# Altium schematic sheet [5]wled.SchDoc
size A
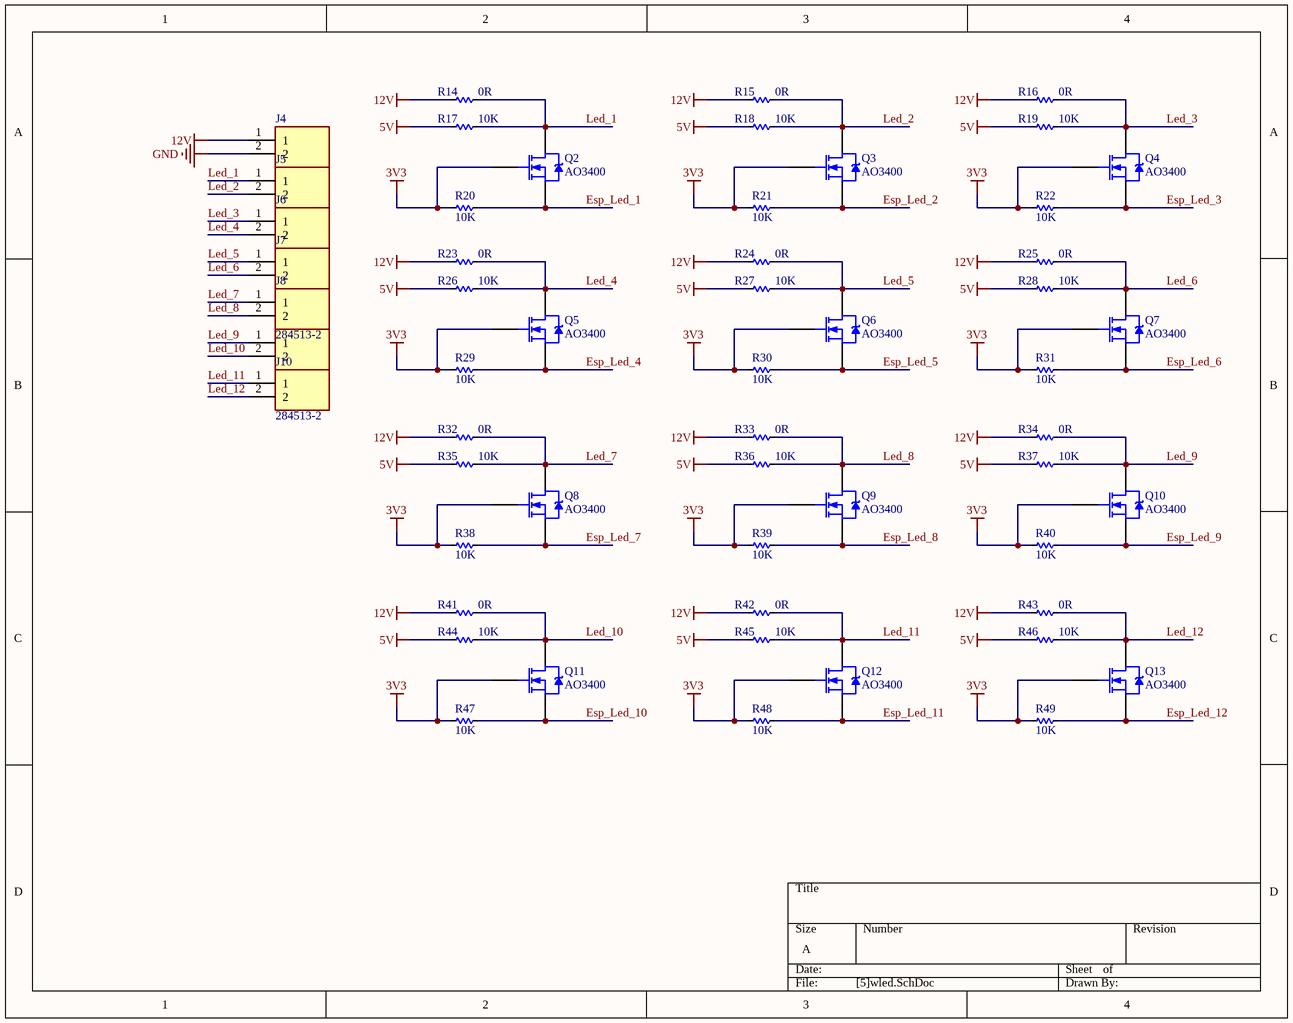
[diagram p0: [5]wled.SchDoc]

## Parts
J4  284513-2  [SHDRRA2W80P0X381_1X2_863X920X730P]
J5  284513-2  [SHDRRA2W80P0X381_1X2_863X920X730P]
J6  284513-2  [SHDRRA2W80P0X381_1X2_863X920X730P]
J7  284513-2  [SHDRRA2W80P0X381_1X2_863X920X730P]
J8  284513-2  [SHDRRA2W80P0X381_1X2_863X920X730P]
J9  284513-2  [SHDRRA2W80P0X381_1X2_863X920X730P]
J10  284513-2  [SHDRRA2W80P0X381_1X2_863X920X730P]
Q2  AO3400  [SOT-23_N]
Q3  AO3400  [SOT-23_N]
Q4  AO3400  [SOT-23_N]
Q5  AO3400  [SOT-23_N]
Q6  AO3400  [SOT-23_N]
Q7  AO3400  [SOT-23_N]
Q8  AO3400  [SOT-23_N]
Q9  AO3400  [SOT-23_N]
Q10  AO3400  [SOT-23_N]
Q11  AO3400  [SOT-23_N]
Q12  AO3400  [SOT-23_N]
Q13  AO3400  [SOT-23_N]
R14  0R  [RES-SMD-0805]
R15  0R  [RES-SMD-0805]
R16  0R  [RES-SMD-0805]
R17  10K  [RES-SMD-0805]
R18  10K  [RES-SMD-0805]
R19  10K  [RES-SMD-0805]
R20  10K  [RES-SMD-0805]
R21  10K  [RES-SMD-0805]
R22  10K  [RES-SMD-0805]
R23  0R  [RES-SMD-0805]
R24  0R  [RES-SMD-0805]
R25  0R  [RES-SMD-0805]
R26  10K  [RES-SMD-0805]
R27  10K  [RES-SMD-0805]
R28  10K  [RES-SMD-0805]
R29  10K  [RES-SMD-0805]
R30  10K  [RES-SMD-0805]
R31  10K  [RES-SMD-0805]
R32  0R  [RES-SMD-0805]
R33  0R  [RES-SMD-0805]
R34  0R  [RES-SMD-0805]
R35  10K  [RES-SMD-0805]
R36  10K  [RES-SMD-0805]
R37  10K  [RES-SMD-0805]
R38  10K  [RES-SMD-0805]
R39  10K  [RES-SMD-0805]
R40  10K  [RES-SMD-0805]
R41  0R  [RES-SMD-0805]
R42  0R  [RES-SMD-0805]
R43  0R  [RES-SMD-0805]
R44  10K  [RES-SMD-0805]
R45  10K  [RES-SMD-0805]
R46  10K  [RES-SMD-0805]
R47  10K  [RES-SMD-0805]
R48  10K  [RES-SMD-0805]
R49  10K  [RES-SMD-0805]

## Nets
3V3: Q2.1(G) Q3.1(G) Q4.1(G) Q5.1(G) Q6.1(G) Q7.1(G) Q8.1(G) Q9.1(G) Q10.1(G) Q11.1(G) Q12.1(G) Q13.1(G) R20.1 R21.1 R22.1 R29.1 R30.1 R31.1 R38.1 R39.1 R40.1 R47.1 R48.1 R49.1
5V: R17.1 R18.1 R19.1 R26.1 R27.1 R28.1 R35.1 R36.1 R37.1 R44.1 R45.1 R46.1
12V: J4.1 R14.1 R15.1 R16.1 R23.1 R24.1 R25.1 R32.1 R33.1 R34.1 R41.1 R42.1 R43.1
GND: J4.2
Esp_Led_1: Q2.2(S) R20.2
Esp_Led_2: Q3.2(S) R21.2
Esp_Led_3: Q4.2(S) R22.2
Esp_Led_4: Q5.2(S) R29.2
Esp_Led_5: Q6.2(S) R30.2
Esp_Led_6: Q7.2(S) R31.2
Esp_Led_7: Q8.2(S) R38.2
Esp_Led_8: Q9.2(S) R39.2
Esp_Led_9: Q10.2(S) R40.2
Esp_Led_10: Q11.2(S) R47.2
Esp_Led_11: Q12.2(S) R48.2
Esp_Led_12: Q13.2(S) R49.2
Led_1: J5.1 Q2.3(D) R14.2 R17.2
Led_2: J5.2 Q3.3(D) R15.2 R18.2
Led_3: J6.1 Q4.3(D) R16.2 R19.2
Led_4: J6.2 Q5.3(D) R23.2 R26.2
Led_5: J7.1 Q6.3(D) R24.2 R27.2
Led_6: J7.2 Q7.3(D) R25.2 R28.2
Led_7: J8.1 Q8.3(D) R32.2 R35.2
Led_8: J8.2 Q9.3(D) R33.2 R36.2
Led_9: J9.1 Q10.3(D) R34.2 R37.2
Led_10: J9.2 Q11.3(D) R41.2 R44.2
Led_11: J10.1 Q12.3(D) R42.2 R45.2
Led_12: J10.2 Q13.3(D) R43.2 R46.2

## Library data of the parts
J4-J10 = 284513-2: Connector; Manufacturer_Name: TE Connectivity; Datasheet Link: https://www.te.com/commerce/DocumentDelivery/DDEController?Action=showdoc&DocId=Catalog+Section%7F1308389_EUROSTYLE_TERMINAL_BLOCKS%7F0607%7Fpdf%7FEnglish%7FENG_CS_1308389_EUROSTYLE_TERMINAL_BLOCKS_0607.pdf%7F284513-2; Height: 7.3mm; Manufacturer_Part_Number: 284513-2; Mouser Part Number: 571-284513-2; Mouser Price/Stock: https://www.mouser.co.uk/ProductDetail/TE-Connectivity/284513-2?qs=woBvfblj%2FzzKKzHe5cbw%252BQ%3D%3D; Arrow Part Number: 284513-2; Arrow Price/Stock: https://www.arrow.com/en/products/284513-2/te-connectivity
Q2-Q13 = IRLML2402: HEXFET Power MOSFET; Published: 8-Jun-2000; LatestRevisionDate: 20-Nov-2009; LatestRevisionNote: IPC-7351 Footprint Added.; DatasheetVersion: Aug-1997; PackageReference: SOT-23; Publisher: Altium Limited; PackageDescription: 3-Pin SOT-23 Package 0.95 mm Pitch, 2.3 mm Lead Span; ComponentLink1Description: Manufacturer Link; ComponentLink1URL: http://www.irf.com/; ComponentLink2Description: Datasheet; ComponentLink2URL: http://www.irf.com/product-info/datasheets/data/irlml2402.pdf
R14-R49 = Res-SMD: Resistor; Manufacturer: Generic Components; Class: Passive; Published: 08/06/2000; Publisher: Altium Hobart Technology Centre